# Altium schematic sheet 2_MOTORES_DE_PASSO.SchDoc
size Tabloid; SheetNumber: 2; SheetTotal: 4; SPICEModelCacheVFRLFGQA: <root> / <DocumentId>VFRLFGQA</DocumentId> / <CacheFrame Number="0"> / <Model Name="0603_885012206023_330nf" Kind="CKT"> / <Text>******* / .subckt 0603_885012206023_330nF 1 2 / Rser 1 3 0.0113479919005 / Lser 2 4 4.48567636E-10 / C1 3 4 0.00000033 / Rpar 3 4 1500000000 / .ends 0603_885012206023_330nF</Text> / </Model> / <Model Name="0603_885012206008_1nf" Kind="CKT"> / <Text>******* / .subckt 0603_885012206008_1nF 1 2 / Rser 1 3 0.24958 / Lser 2 4 0.00000000040399 / C1 3 4 0.000000001 / Rpar 3 4 10000000000 / .ends 0603_885012206008_1nF</Text> / </Model> / <Model Name="0603_885012206014_10nf" Kind="CKT"> / <Text>******* / .subckt 0603_885012206014_10nF 1 2 / Rser 1 3 0.04641 / Lser 2 4 0.00000000025735 / C1 3 4 0.00000001 / Rpar 3 4 10000000000 / .ends 0603_885012206014_10nF</Text> / </Model> / <Model Name="0603_885012206121_330nf" Kind="CKT"> / <Text>******* / .subckt 0603_885012206121_330nF 1 2 / Rser 1 3 0.0116331902783 / Lser 2 4 2.98906197E-10 / C1 3 4 0.00000033 / Rpar 3 4 1500000000 / .ends 0603_885012206121_330nF</Text> / </Model> / <Model Name="865080649011_33uf" Kind="CKT"> / <Text>******* / .subckt 865080649011_33uF 1 2 / Rser 1 3 0.64 / Lser 2 4 0.000000003917 / C1 3 4 0.000033 / Rpar 3 4 3030303.03030303 / .ends 865080649011_33uF</Text> / </Model> / </CacheFrame> / </root>
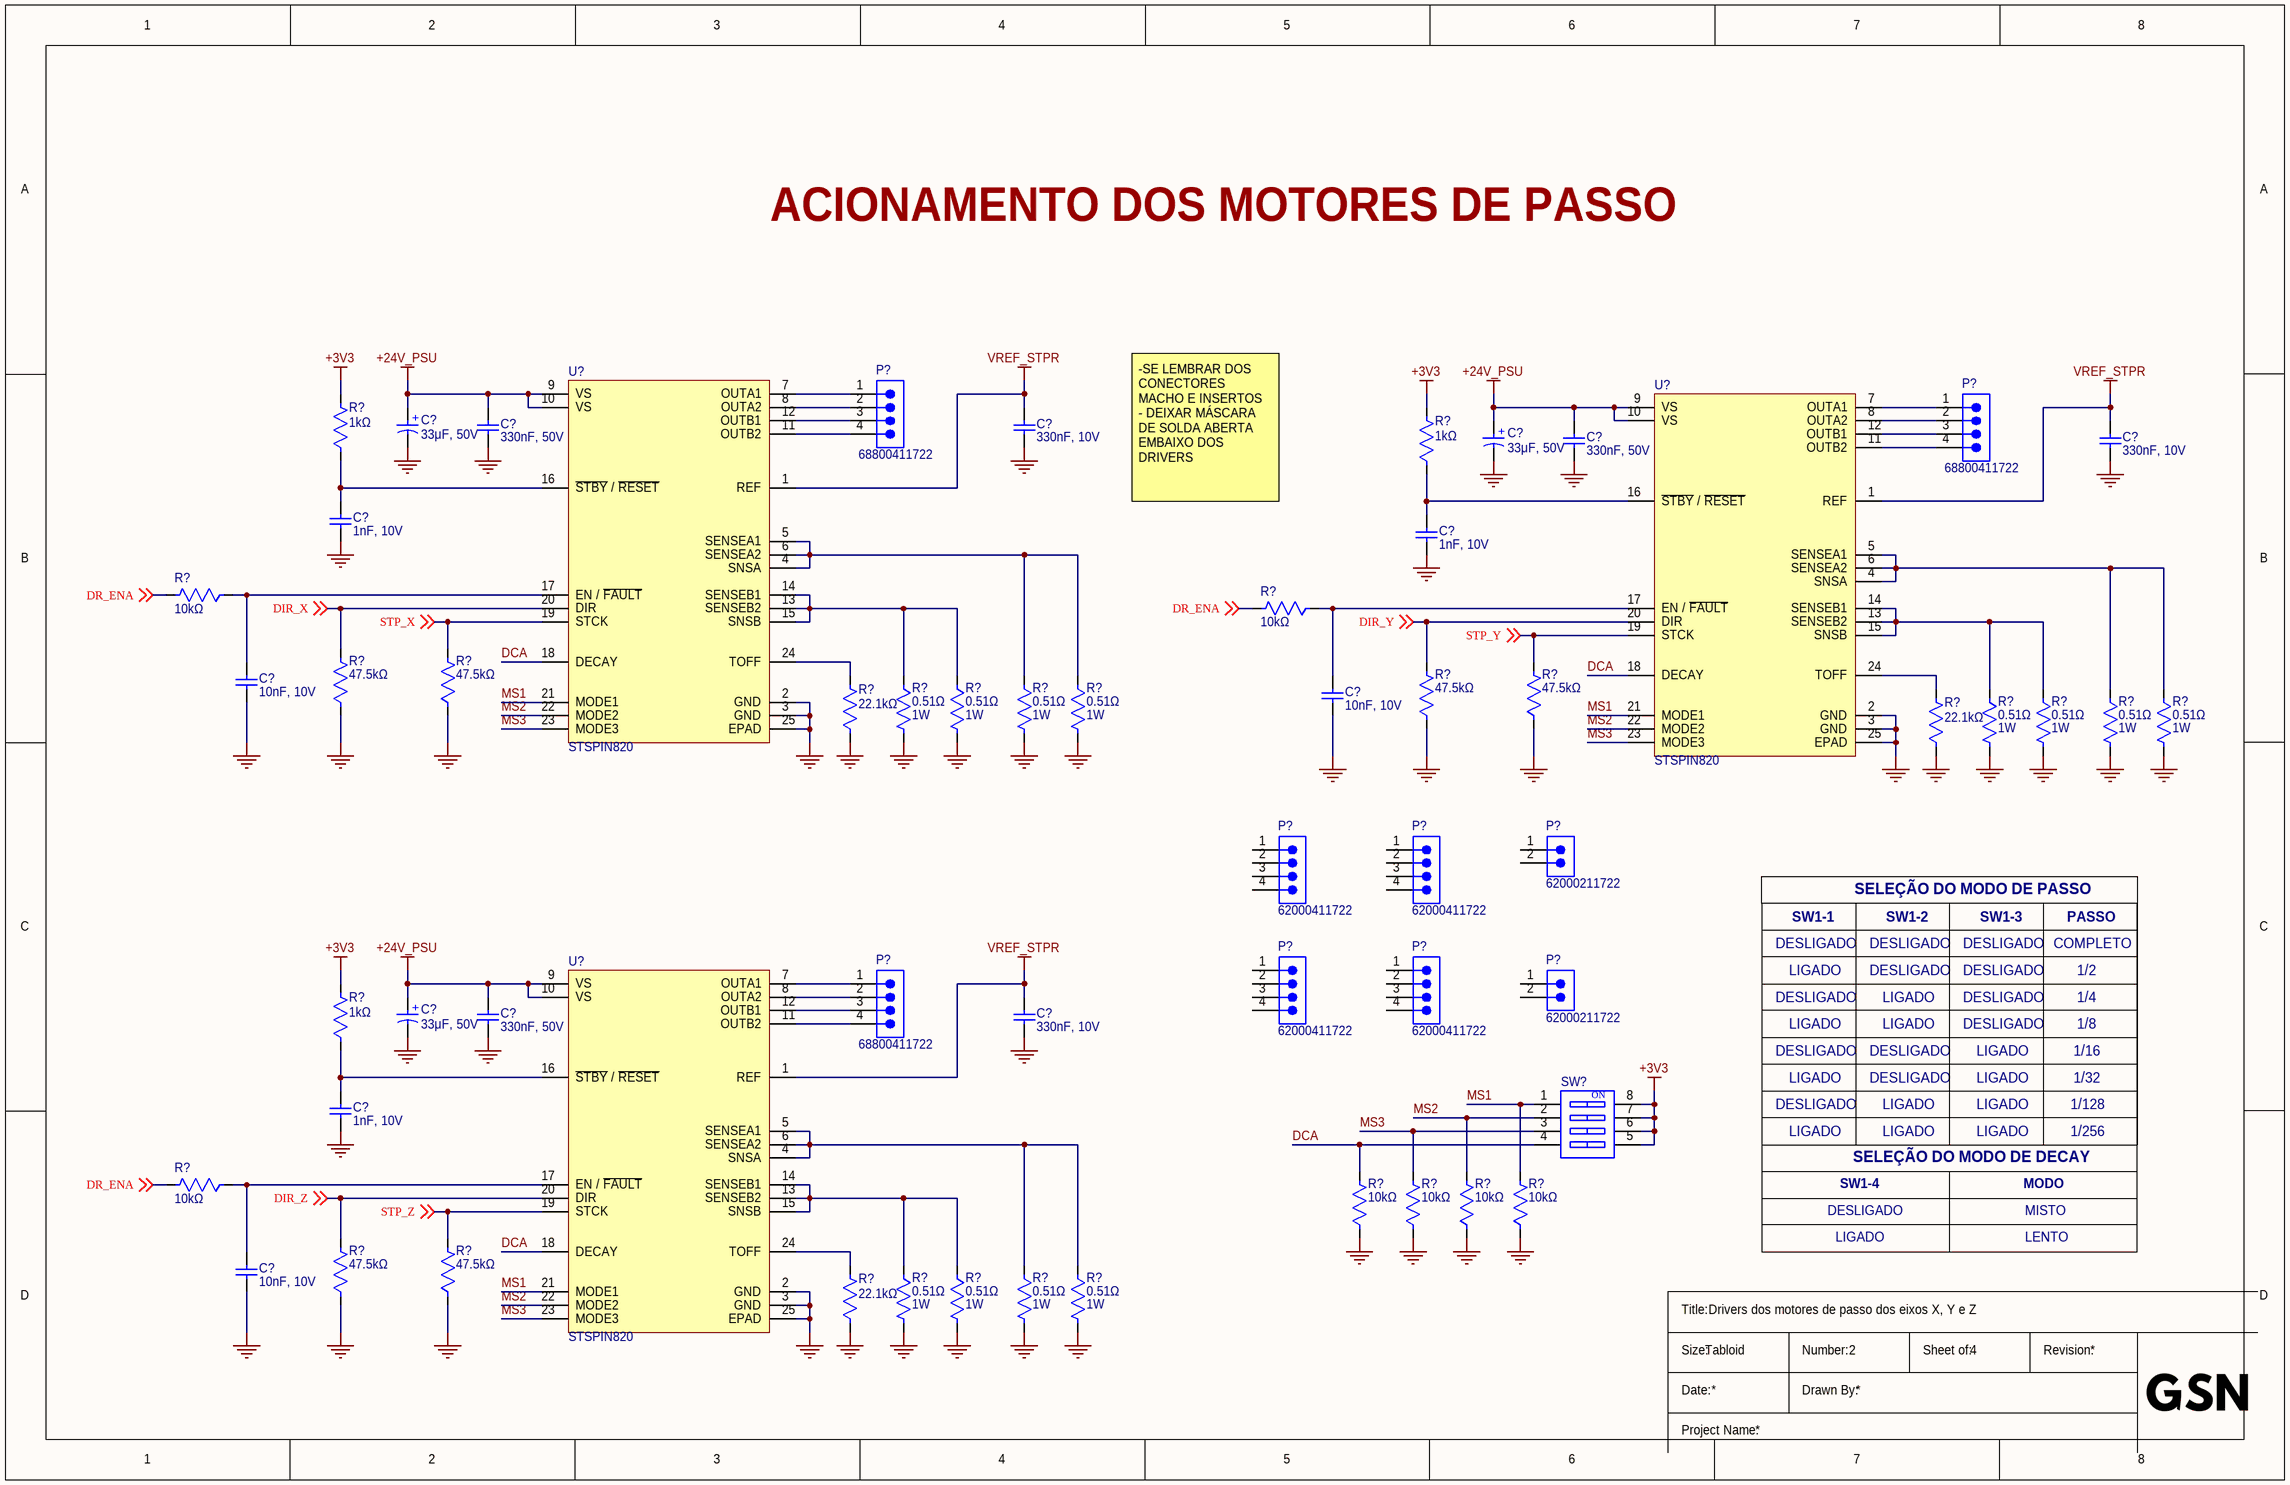
[diagram p0: 2_MOTORES_DE_PASSO.SchDoc]

## Parts
(Parts that share a designator on the sheet are numbered #1, #2 ... from top to bottom, then left to right.)
C?#1  33μF, 50V  [WCAP-ASLI_D8H6.5]
C?#2  33μF, 50V  [WCAP-ASLI_D8H6.5]
C?#3  330nF, 50V  [WCAP-CSGP_0603_L1.6W0.8H0.8_Reflow]
C?#4  330nF, 10V  [WCAP-CSGP_0603_L1.6W0.8H0.8_Reflow]
C?#5  330nF, 50V  [WCAP-CSGP_0603_L1.6W0.8H0.8_Reflow]
C?#6  330nF, 10V  [WCAP-CSGP_0603_L1.6W0.8H0.8_Reflow]
C?#7  1nF, 10V  [WCAP-CSGP_0603_L1.6W0.8H0.8_Reflow]
C?#8  1nF, 10V  [WCAP-CSGP_0603_L1.6W0.8H0.8_Reflow]
C?#9  10nF, 10V  [WCAP-CSGP_0603_L1.6W0.8H0.8_Reflow]
C?#10  10nF, 10V  [WCAP-CSGP_0603_L1.6W0.8H0.8_Reflow]
C?#11  33μF, 50V  [WCAP-ASLI_D8H6.5]
C?#12  330nF, 50V  [WCAP-CSGP_0603_L1.6W0.8H0.8_Reflow]
C?#13  330nF, 10V  [WCAP-CSGP_0603_L1.6W0.8H0.8_Reflow]
C?#14  1nF, 10V  [WCAP-CSGP_0603_L1.6W0.8H0.8_Reflow]
C?#15  10nF, 10V  [WCAP-CSGP_0603_L1.6W0.8H0.8_Reflow]
P?#1  68800411722  [68800411722]
P?#2  68800411722  [68800411722]
P?#3  62000411722  [62000411722]
P?#4  62000411722  [62000411722]
P?#5  62000211722  [62000211722]
P?#6  62000411722  [62000411722]
P?#7  62000411722  [62000411722]
P?#8  68800411722  [68800411722]
P?#9  62000211722  [62000211722]
R?#1  1kΩ  [0603-REFLOW]
R?#2  1kΩ  [0603-REFLOW]
R?#3  10kΩ  [0603-REFLOW]
R?#4  10kΩ  [0603-REFLOW]
R?#5  0.51Ω  Power Rating: 1W  [2010-REFLOW]
R?#6  0.51Ω  Power Rating: 1W  [2010-REFLOW]
R?#7  0.51Ω  Power Rating: 1W  [2010-REFLOW]
R?#8  0.51Ω  Power Rating: 1W  [2010-REFLOW]
R?#9  0.51Ω  Power Rating: 1W  [2010-REFLOW]
R?#10  0.51Ω  Power Rating: 1W  [2010-REFLOW]
R?#11  0.51Ω  Power Rating: 1W  [2010-REFLOW]
R?#12  0.51Ω  Power Rating: 1W  [2010-REFLOW]
R?#13  47.5kΩ  [0603-REFLOW]
R?#14  47.5kΩ  [0603-REFLOW]
R?#15  47.5kΩ  [0603-REFLOW]
R?#16  47.5kΩ  [0603-REFLOW]
R?#17  22.1kΩ  [0603-REFLOW]
R?#18  22.1kΩ  [0603-REFLOW]
R?#19  1kΩ  [0603-REFLOW]
R?#20  10kΩ  [0603-REFLOW]
R?#21  10kΩ  [0603-REFLOW]
R?#22  10kΩ  [0603-REFLOW]
R?#23  10kΩ  [0603-REFLOW]
R?#24  10kΩ  [0603-REFLOW]
R?#25  0.51Ω  Power Rating: 1W  [2010-REFLOW]
R?#26  0.51Ω  Power Rating: 1W  [2010-REFLOW]
R?#27  0.51Ω  Power Rating: 1W  [2010-REFLOW]
R?#28  0.51Ω  Power Rating: 1W  [2010-REFLOW]
R?#29  47.5kΩ  [0603-REFLOW]
R?#30  47.5kΩ  [0603-REFLOW]
R?#31  22.1kΩ  [0603-REFLOW]
SW?  416131160804  [416131160804]  (value not drawn)
U?#1  STSPIN820  [24-TQFPN]
U?#2  STSPIN820  [24-TQFPN]
U?#3  STSPIN820  [24-TQFPN]

## Nets
+3V3: R?#1.2 R?#2.2 R?#19.2 SW?.5 SW?.6 SW?.7 SW?.8
+24V_PSU: C?#1.1(P) C?#2.1(P) C?#3.2 C?#5.2 C?#11.1(P) C?#12.2 U?#1.9(VS) U?#1.10(VS) U?#2.9(VS) U?#2.10(VS) U?#3.9(VS) U?#3.10(VS)
GND: C?#1.2(N) C?#2.2(N) C?#3.1 C?#4.1 C?#5.1 C?#6.1 C?#7.1 C?#8.1 C?#9.1 C?#10.1 C?#11.2(N) C?#12.1 C?#13.1 C?#14.1 C?#15.1 R?#5.2 R?#6.2 R?#7.2 R?#8.2 R?#9.2 R?#10.2 R?#11.2 R?#12.2 R?#13.1 R?#14.1 R?#15.1 R?#16.1 R?#17.1 R?#18.1 R?#21.1 R?#22.1 R?#23.1 R?#24.1 R?#25.2 R?#26.2 R?#27.2 R?#28.2 R?#29.1 R?#30.1 R?#31.1 U?#1.2(GND) U?#1.3(GND) U?#1.25(EPAD) U?#2.2(GND) U?#2.3(GND) U?#2.25(EPAD) U?#3.2(GND) U?#3.3(GND) U?#3.25(EPAD)
VREF_STPR: C?#4.2 C?#6.2 C?#13.2 U?#1.1(REF) U?#2.1(REF) U?#3.1(REF)
DCA: R?#21.2 SW?.4 U?#1.18(DECAY) U?#2.18(DECAY) U?#3.18(DECAY)
DIR_X: R?#13.2 U?#1.20(DIR) ; off-sheet DIR_X
DIR_Y: R?#15.2 U?#2.20(DIR) ; off-sheet DIR_Y
DIR_Z: R?#29.2 U?#3.20(DIR) ; off-sheet DIR_Z
DR_ENA: R?#3.2 R?#4.2 R?#20.2 ; off-sheet DR_ENA
MS1: R?#24.2 SW?.1 U?#1.21(MODE1) U?#2.21(MODE1) U?#3.21(MODE1)
MS2: R?#23.2 SW?.2 U?#1.22(MODE2) U?#2.22(MODE2) U?#3.22(MODE2)
MS3: R?#22.2 SW?.3 U?#1.23(MODE3) U?#2.23(MODE3) U?#3.23(MODE3)
STP_X: R?#14.2 U?#1.19(STCK) ; off-sheet STP_X
STP_Y: R?#16.2 U?#2.19(STCK) ; off-sheet STP_Y
STP_Z: R?#30.2 U?#3.19(STCK) ; off-sheet STP_Z
NetC?#7_2: C?#7.2 R?#1.1 U?#1.16(~{STBY}_/_~{RESET})
NetC?#8_2: C?#8.2 R?#2.1 U?#2.16(~{STBY}_/_~{RESET})
NetC?#9_2: C?#9.2 R?#3.1 U?#1.17(EN_/_~{FAULT})
NetC?#10_2: C?#10.2 R?#4.1 U?#2.17(EN_/_~{FAULT})
NetC?#14_2: C?#14.2 R?#19.1 U?#3.16(~{STBY}_/_~{RESET})
NetC?#15_2: C?#15.2 R?#20.1 U?#3.17(EN_/_~{FAULT})
NetP?#1_1: P?#1.1 U?#1.7(OUTA1)
NetP?#1_2: P?#1.2 U?#1.8(OUTA2)
NetP?#1_3: P?#1.3 U?#1.12(OUTB1)
NetP?#1_4: P?#1.4 U?#1.11(OUTB2)
NetP?#2_1: P?#2.1 U?#2.7(OUTA1)
NetP?#2_2: P?#2.2 U?#2.8(OUTA2)
NetP?#2_3: P?#2.3 U?#2.12(OUTB1)
NetP?#2_4: P?#2.4 U?#2.11(OUTB2)
NetP?#8_1: P?#8.1 U?#3.7(OUTA1)
NetP?#8_2: P?#8.2 U?#3.8(OUTA2)
NetP?#8_3: P?#8.3 U?#3.12(OUTB1)
NetP?#8_4: P?#8.4 U?#3.11(OUTB2)
NetR?#5_1: R?#5.1 R?#6.1 U?#1.13(SENSEB2) U?#1.14(SENSEB1) U?#1.15(SNSB)
NetR?#7_1: R?#7.1 R?#8.1 U?#1.4(SNSA) U?#1.5(SENSEA1) U?#1.6(SENSEA2)
NetR?#9_1: R?#9.1 R?#10.1 U?#2.13(SENSEB2) U?#2.14(SENSEB1) U?#2.15(SNSB)
NetR?#11_1: R?#11.1 R?#12.1 U?#2.4(SNSA) U?#2.5(SENSEA1) U?#2.6(SENSEA2)
NetR?#17_2: R?#17.2 U?#1.24(TOFF)
NetR?#18_2: R?#18.2 U?#2.24(TOFF)
NetR?#25_1: R?#25.1 R?#26.1 U?#3.13(SENSEB2) U?#3.14(SENSEB1) U?#3.15(SNSB)
NetR?#27_1: R?#27.1 R?#28.1 U?#3.4(SNSA) U?#3.5(SENSEA1) U?#3.6(SENSEA2)
NetR?#31_2: R?#31.2 U?#3.24(TOFF)

Not connected (* = marked no-connect by the designer): P?#3 1 2 3 4; P?#4 1 2 3 4; P?#5 1 2; P?#6 1 2 3 4; P?#7 1 2 3 4; P?#9 1 2

## Notes on the sheet
- ACIONAMENTO DOS MOTORES DE PASSO
- -SE LEMBRAR DOS CONECTORES MACHO E INSERTOS
  - DEIXAR MÁSCARA DE SOLDA ABERTA EMBAIXO DOS DRIVERS
- SELEÇÃO DO MODO DE PASSO
- DESLIGADO
- SW1-1
- SW1-2
- SW1-3
- COMPLETO
- PASSO
- LIGADO
- 1/2
- 1/4
- 1/8
- 1/16
- 1/32
- SELEÇÃO DO MODO DE DECAY
- 1/128
- 1/256
- SW1-4
- MODO
- MISTO
- LENTO
- Drivers dos motores de passo dos eixos X, Y e Z
- Title:
- Size:
- Tabloid
- Number:
- Sheet of:
- Revision:
- Date:
- Project Name:
- Drawn By:
- (in symbol 416131160804) ON
- (in symbol 865080649011) +

## Library data of the parts
C?#1 C?#2 C?#11 = 865080649011: WCAP-ASLI Aluminum Electrolytic Capacitor, V-Chip, SMT, 8mm x 6.5mm, 33μF, 50V; Manufacturer: Wurth Elektronik; Capacitance: 33uF; Dissipation Factor: 12%; Endurance: 2000h; Impedance: 700mohm; Leakage Current: 16.5uA; Ripple Current: 200mA; Manufacturer Part Number: 865080649011; Category: Aluminum Electrolytic Capacitors; Match Code: WCAP-ASLI; ComponentLink1Description: Website Link; ComponentLink1URL: https://www.we-online.com/redexpert/article/865080649011?ad; ComponentLink2Description: Datasheet Link; ComponentLink2URL: https://www.we-online.com/redexpert/spec/865080649011?ad; Mount: Surface Mount; Operating Temperature Min: -55degC; Operating Temperature Max: 105degC; Packaging: Tape and Reel; Height: 6.5mm; Diameter: 8mm; Rated Voltage (DC): 50V
C?#3 C?#5 C?#12 = 885012206121: WCAP-CSGP Multilayer Ceramic Chip Capacitor, General Purpose, size 0603, 330nF, 50V; Manufacturer: Wurth Elektronik; Case/Size Code: 0603; Capacitance Tolerance: +/-10%; Ceramic Type: X7R; Dissipation Factor: 10%; Insulation Resistance: 1.5GΩ; Technical Reference: X7R0603334K050DFCT10000; Manufacturer Part Number: 885012206121; Category: Multilayer Ceramic Chip Capacitors; Match Code: WCAP-CSGP; ComponentLink1Description: Website Link; ComponentLink1URL: https://www.we-online.com/redexpert/article/885012206121?ad; ComponentLink2Description: Datasheet Link; ComponentLink2URL: https://www.we-online.com/redexpert/spec/885012206121?ad; Mount: Surface Mount; Min Operating Temperature: -55°C; Max Operating Temperature: 125°C; Packaging: Tape and Reel; Length: 1.6mm; Width: 0.8mm; Height: 0.8mm; Capacitance: 330nF; Rated Voltage (DC): 50V
C?#4 C?#6 C?#13 = 885012206023: WCAP-CSGP Multilayer Ceramic Chip Capacitor, General Purpose, size 0603, 330nF, 10V; Manufacturer: Wurth Elektronik; Case/Size Code: 0603; Capacitance Tolerance: +/-10%; Ceramic Type: X7R; Dissipation Factor: 10%; Insulation Resistance: 1.5GΩ; Technical Reference: X7R0603334K010DFCT10000; Manufacturer Part Number: 885012206023; Category: Multilayer Ceramic Chip Capacitors; Match Code: WCAP-CSGP; ComponentLink1Description: Website Link; ComponentLink1URL: https://www.we-online.com/redexpert/article/885012206023?ad; ComponentLink2Description: Datasheet Link; ComponentLink2URL: https://www.we-online.com/redexpert/spec/885012206023?ad; Mount: Surface Mount; Min Operating Temperature: -55°C; Max Operating Temperature: 125°C; Packaging: Tape and Reel; Length: 1.6mm; Width: 0.8mm; Height: 0.8mm; Capacitance: 330nF; Rated Voltage (DC): 10V
C?#7 C?#8 C?#14 = 885012206008: WCAP-CSGP Multilayer Ceramic Chip Capacitor, General Purpose, size 0603, 1nF, 10V; Manufacturer: Wurth Elektronik; Case/Size Code: 0603; Capacitance Tolerance: +/-10%; Ceramic Type: X7R; Dissipation Factor: 5%; Insulation Resistance: 10GΩ; Technical Reference: X7R0603102K010DFCT10000; Manufacturer Part Number: 885012206008; Category: Multilayer Ceramic Chip Capacitors; Match Code: WCAP-CSGP; ComponentLink1Description: Website Link; ComponentLink1URL: https://www.we-online.com/redexpert/article/885012206008?ad; ComponentLink2Description: Datasheet Link; ComponentLink2URL: https://www.we-online.com/redexpert/spec/885012206008?ad; Mount: Surface Mount; Min Operating Temperature: -55°C; Max Operating Temperature: 125°C; Packaging: Tape and Reel; Length: 1.6mm; Width: 0.8mm; Height: 0.8mm; Capacitance: 1nF; Rated Voltage (DC): 10V
C?#9 C?#10 C?#15 = 885012206014: WCAP-CSGP Multilayer Ceramic Chip Capacitor, General Purpose, size 0603, 10nF, 10V; Manufacturer: Wurth Elektronik; Case/Size Code: 0603; Capacitance Tolerance: +/-10%; Ceramic Type: X7R; Dissipation Factor: 5%; Insulation Resistance: 10GΩ; Technical Reference: X7R0603103K010DFCT10000; Manufacturer Part Number: 885012206014; Category: Multilayer Ceramic Chip Capacitors; Match Code: WCAP-CSGP; ComponentLink1Description: Website Link; ComponentLink1URL: https://www.we-online.com/redexpert/article/885012206014?ad; ComponentLink2Description: Datasheet Link; ComponentLink2URL: https://www.we-online.com/redexpert/spec/885012206014?ad; Mount: Surface Mount; Min Operating Temperature: -55°C; Max Operating Temperature: 125°C; Packaging: Tape and Reel; Length: 1.6mm; Width: 0.8mm; Height: 0.8mm; Capacitance: 10nF; Rated Voltage (DC): 10V
P?#1 P?#2 P?#8 = 68800411722: WR-WTB “J” Type THT Male Horizontal Shrouded Header, pitch 2.5 mm, 4 pins; Manufacturer: Wurth Elektronik; Contact Resistance: 20 mohm; Rated Current: 3 A; Working Voltage: 250 V(AC); Withstanding Voltage: 800 V(AC); Manufacturer Part Number: 68800411722; Category: Wire-to-Board Connector; Match Code: WR-WTB; ComponentLink1Description: Website Link; ComponentLink1URL: https://www.we-online.com/redexpert/article/68800411722?ad; ComponentLink2Description: Datasheet Link; ComponentLink2URL: https://www.we-online.com/redexpert/spec/68800411722?ad; Mount: Through Hole; Operating Temperature Min: -25degC; Operating Temperature Max: 85degC; Packaging: Bag; Length: 12.5 mm; Width: 8.3 mm; Height: 4.2 mm; Gender: Male; Number of Pins: 4; Number of Rows: 1; Orientation: Horizontal; Lead Pitch: 2.5 mm
P?#3 P?#4 P?#6 P?#7 = 62000411722: WR-WTB THT Male Horizontal Shrouded Header, pitch 2 mm, 4 pins; Manufacturer: Wurth Elektronik; Contact Resistance: 20 mohm; Rated Current: 2 A; Working Voltage: 125 V(AC); Withstanding Voltage: 800 V(AC); Manufacturer Part Number: 62000411722; Category: Wire-to-Board Connector; Match Code: WR-WTB; ComponentLink1Description: Website Link; ComponentLink1URL: https://www.we-online.com/redexpert/article/62000411722?ad; ComponentLink2Description: Datasheet Link; ComponentLink2URL: https://www.we-online.com/redexpert/spec/62000411722?ad; Mount: Through Hole; Operating Temperature Min: -25degC; Operating Temperature Max: 85degC; Packaging: Bag; Length: 10 mm; Width: 7.6 mm; Height: 4.5 mm; Gender: Male; Number of Pins: 4; Number of Rows: 1; Orientation: Horizontal; Lead Pitch: 2 mm
P?#5 P?#9 = 62000211722: WR-WTB THT Male Horizontal Shrouded Header, pitch 2 mm, 2 pins; Manufacturer: Wurth Elektronik; Contact Resistance: 20 mohm; Rated Current: 2 A; Working Voltage: 125 V(AC); Withstanding Voltage: 800 V(AC); Manufacturer Part Number: 62000211722; Category: Wire-to-Board Connector; Match Code: WR-WTB; ComponentLink1Description: Website Link; ComponentLink1URL: https://www.we-online.com/redexpert/article/62000211722?ad; ComponentLink2Description: Datasheet Link; ComponentLink2URL: https://www.we-online.com/redexpert/spec/62000211722?ad; Mount: Through Hole; Operating Temperature Min: -25degC; Operating Temperature Max: 85degC; Packaging: Bag; Length: 6 mm; Width: 7.6 mm; Height: 4.5 mm; Gender: Male; Number of Pins: 2; Number of Rows: 1; Orientation: Horizontal; Lead Pitch: 2 mm
R?#1 R?#2 R?#19 = RC0603FR-071KL: RES 1K OHM 1% 1/10W 0603; Manufacturer: Yageo Group; Max Power Dissipation: 100mW; Temperature Coefficient: ±200ppm/°C; Voltage Rating (AC): 50V; Voltage Rating: 75V; Supplier Part Number: 311-1.00KHRCT-ND; Manufacturer Part Number: RC0603FR-071KL; Value: 1kΩ; Case Code (Imperial): 0603; Case Code (Metric): 1608; Case/Package: 0603; Category: Chip SMD Resistors; China RoHS: Non-Compliant; Composition: Thick Film; Contact Plating: Tin; Depth: 800µm; Features: Moisture Resistant; Height: 450µm; Lead Free: Lead Free; Length: 1.6mm; Lifecycle Status: Production; Max Operating Temperature: 155°C; Military Standard: Not; Min Operating Temperature: -55°C; Mounting Technology: Surface Mount; Number of Terminals: 2; Number of Terminations: 2; Packaging: Tape & Reel; Power Dissipation: 100mW; Power Rating: 100mW; Radiation Hardening: No; REACH SVHC: Yes; RoHS: Compliant; Supplier: DigiKey; Termination: SMD/SMT; Tolerance: 1%; Component Link Description: https://www.yageogroup.com/content/datasheet/asset/file/PYU-RC_GROUP_51_ROHS_L; Component Link URL: https://www.yageogroup.com/content/datasheet/asset/file/PYU-RC_GROUP_51_ROHS_L; Datasheet: https://www.yageogroup.com/content/datasheet/asset/file/PYU-RC_GROUP_51_ROHS_L; Voltage Rating (DC): 50V; Weight: 2.012816mg; Width: 800µm; Working Voltage: 75V
R?#3 R?#4 R?#20-R?#24 = RC0603FR-0710KL: RES 10K OHM 1% 1/10W 0603; Manufacturer: Yageo Group; Max Power Dissipation: 100mW; Temperature Coefficient: ±200ppm/°C; Voltage Rating (AC): 50V; Voltage Rating: 75V; Supplier Part Number: 311-10.0KHRCT-ND; Manufacturer Part Number: RC0603FR-0710KL; Value: 10kΩ; Case Code (Imperial): 0603; Case Code (Metric): 1608; Case/Package: 0603; Category: Chip SMD Resistors; China RoHS: Non-Compliant; Composition: Thick Film; Contact Plating: Tin; Depth: 800µm; Features: Moisture Resistant; Height: 450µm; Lead Free: Lead Free; Length: 1.6mm; Lifecycle Status: Production; Max Operating Temperature: 155°C; Military Standard: Not; Min Operating Temperature: -55°C; Mounting Technology: Surface Mount; Number of Terminals: 2; Number of Terminations: 2; Packaging: Tape & Reel; Power Dissipation: 100mW; Power Rating: 100mW; Radiation Hardening: No; REACH SVHC: Yes; RoHS: Compliant; Supplier: DigiKey; Termination: SMD/SMT; Tolerance: 1%; Component Link Description: https://www.yageogroup.com/content/datasheet/asset/file/PYU-RC_GROUP_51_ROHS_L; Component Link URL: https://www.yageogroup.com/content/datasheet/asset/file/PYU-RC_GROUP_51_ROHS_L; Datasheet: https://www.yageogroup.com/content/datasheet/asset/file/PYU-RC_GROUP_51_ROHS_L; Voltage Rating (DC): 50V; Weight: 2.012816mg; Width: 800µm; Working Voltage: 75V
R?#5-R?#12 R?#25-R?#28 = RCWE2010R510FKEA: RES 0.51 OHM 1% 1W 2010; Manufacturer: Vishay; Value: 510mΩ; Temperature Coefficient: 100ppm/°C; Working Voltage: 714.1mV; Supplier: DigiKey; Supplier Part Number: RCWE.51GCT-ND; Manufacturer Part Number: RCWE2010R510FKEA; RoHS: Compliant; Category: Chip SMD Resistors; Stock: 6435; Pricing: 1=0.65, 10=0.417, 25=0.3544, 50=0.3156, 100=0.2824, 250=0.24596, 500=0.22314, 1000=0.20376 (USD); Case/Package: 2010; Case Code (Imperial): 2010; Case Code (Metric): 5025; China RoHS: Non-Compliant; Composition: Thick Film; Contact Plating: Tin; Features: Automotive AEC-Q200, Moisture Resistant; Height: 600µm; Length: 5.0038mm; Lifecycle Status: Production; Max Operating Temperature: 155°C; Max Power Dissipation: 1W; Min Operating Temperature: -55°C; Mounting Technology: Surface Mount; Pins: 2; Number of Terminals: 2; Number of Terminations: 2; Power Dissipation: 1W; Radiation Hardening: No; REACH SVHC: Yes; Schedule B: 8533210045, 8533210045|8533210045|8533210045|8533210045|8533210045; Termination: SMD/SMT; Tolerance: 1%; Width: 2.5mm; ComponentLink1URL: https://datasheet.octopart.com:443/RCWE2010R510FKEA-Vishay-datasheet-170667730.pdf?src-supplier=IHS; ComponentLink1Description: https://datasheet.octopart.com:443/RCWE2010R510FKEA-Vishay-datasheet-170667730.pdf?src-supplier=IHS; ComponentLink2URL: https://datasheet.octopart.com:443/RCWE2010R510FKEA-Vishay-datasheet-78835242.pdf?src-supplier=Newark; ComponentLink2Description: https://datasheet.octopart.com:443/RCWE2010R510FKEA-Vishay-datasheet-78835242.pdf?src-supplier=Newark; ComponentLink3URL: https://datasheet.octopart.com:443/RCWE2010R510FKEA-Vishay-datasheet-10025643.pdf?src-supplier=element14+APAC; ComponentLink3Description: https://datasheet.octopart.com:443/RCWE2010R510FKEA-Vishay-datasheet-10025643.pdf?src-supplier=element14+APAC; ComponentLink4URL: http://sigma.octopart.com:80/rohs_statement/Vishay-company-15.pdf?src-supplier=Compliance+Statements; ComponentLink4Description: http://sigma.octopart.com:80/rohs_statement/Vishay-company-15.pdf?src-supplier=Compliance+Statements
R?#13-R?#16 R?#29 R?#30 = RC0603FR-0747K5L: RES 47.5K OHM 1% 1/10W 0603; Manufacturer: Yageo Group; Max Power Dissipation: 100mW; Temperature Coefficient: ±200ppm/°C; Voltage Rating (AC): 50V; Voltage Rating: 75V; Supplier Part Number: 311-47.5KHRCT-ND; Manufacturer Part Number: RC0603FR-0747K5L; Value: 47.5kΩ; Case Code (Imperial): 0603; Case Code (Metric): 1608; Case/Package: 0603; Category: Chip SMD Resistors; China RoHS: Non-Compliant; Composition: Thick Film; Contact Plating: Tin; Depth: 800µm; Features: Moisture Resistant; Height: 450µm; Lead Free: Lead Free; Length: 1.6mm; Lifecycle Status: Production; Max Operating Temperature: 155°C; Military Standard: Not; Min Operating Temperature: -55°C; Mounting Technology: Surface Mount; Number of Terminals: 2; Number of Terminations: 2; Packaging: Tape & Reel; Power Dissipation: 100mW; Power Rating: 100mW; Radiation Hardening: No; REACH SVHC: Yes; RoHS: Compliant; Supplier: DigiKey; Termination: SMD/SMT; Tolerance: 1%; Component Link Description: https://www.yageogroup.com/content/datasheet/asset/file/PYU-RC_GROUP_51_ROHS_L; Component Link URL: https://www.yageogroup.com/content/datasheet/asset/file/PYU-RC_GROUP_51_ROHS_L; Datasheet: https://www.yageogroup.com/content/datasheet/asset/file/PYU-RC_GROUP_51_ROHS_L; Voltage Rating (DC): 50V; Weight: 2.012816mg; Width: 800µm; Working Voltage: 75V
R?#17 R?#18 R?#31 = RC0603FR-0722K1L: RES 22.1K OHM 1% 1/10W 0603; Manufacturer: Yageo Group; Max Power Dissipation: 100mW; Temperature Coefficient: ±200ppm/°C; Voltage Rating (AC): 50V; Voltage Rating: 75V; Supplier Part Number: 311-22.1KHRCT-ND; Manufacturer Part Number: RC0603FR-0722K1L; Value: 22.1kΩ; Case Code (Imperial): 0603; Case Code (Metric): 1608; Case/Package: 0603; Category: Chip SMD Resistors; China RoHS: Non-Compliant; Composition: Thick Film; Contact Plating: Tin; Depth: 800µm; Features: Moisture Resistant; Height: 450µm; Lead Free: Lead Free; Length: 1.6mm; Lifecycle Status: Production; Max Operating Temperature: 155°C; Military Standard: Not; Min Operating Temperature: -55°C; Mounting Technology: Surface Mount; Number of Terminals: 2; Number of Terminations: 2; Packaging: Tape & Reel; Power Dissipation: 100mW; Power Rating: 100mW; Radiation Hardening: No; REACH SVHC: Yes; RoHS: Compliant; Supplier: DigiKey; Termination: SMD/SMT; Tolerance: 1%; Component Link Description: https://www.yageogroup.com/content/datasheet/asset/file/PYU-RC_GROUP_51_ROHS_L; Component Link URL: https://www.yageogroup.com/content/datasheet/asset/file/PYU-RC_GROUP_51_ROHS_L; Datasheet: https://www.yageogroup.com/content/datasheet/asset/file/PYU-RC_GROUP_51_ROHS_L; Voltage Rating (DC): 50V; Weight: 2.012816mg; Width: 800µm; Working Voltage: 75V
SW? = 416131160804: WS-DISV Small Compact SMD Dip Switch, Flat Actuator with Top Tape, pitch 1.27mm, 4p; Manufacturer: Wurth Elektronik; Actuator Type: Flat Type; Operation Force: 500g; Number of Poles: 4; Rated Current Non-Switching: 100mA; Rated Current Switching: 25mA; Rated Voltage Non-Switching: 50VDC; Rated Voltage Switching: 24VDC; Manufacturer Part Number: 416131160804; Category: Dip Switches; Match Code: WS-DISV; ComponentLink1Description: Website Link; ComponentLink1URL: https://www.we-online.com/redexpert/article/416131160804?ad; ComponentLink2Description: Datasheet Link; ComponentLink2URL: https://www.we-online.com/redexpert/spec/416131160804?ad; Mount: Surface Mount; Min Operating Temperature: -40°C; Max Operating Temperature: 85°C; Packaging: Tape and Reel; Contact Material: Copper Alloy; Contact Plating: Gold; Pitch: 1.27mm
U?#1-U?#3 = STSPIN820: IC MTR DRVR BIPLR 7-45V 24TFQFPN; Manufacturer: STMicroelectronics; Throw Configuration: STEPPER MOTOR CONTROLLER; Supplier: Digikey; Supplier Part Number: 497-17713-1-ND; Manufacturer Part Number: STSPIN820; RoHS: Yes; Category: Motor Drives; Stock: 11767; Pricing: 1=3.03, 10=2.271, 25=2.0804, 100=1.8709, 250=1.77096, 500=1.71068, 1000=1.66108 (USD); Reach SVHC Compliant: Yes; RoHS Compliant: Yes; ComponentLink1URL: https://datasheet.ciiva.com:443/pdfs/VipMasterIC/IC/SGST/SGST-S-A0005002811/SGST-S-A0005002811-1.pdf?src-supplier=IHS+Markit; ComponentLink1Description: https://datasheet.ciiva.com:443/pdfs/VipMasterIC/IC/SGST/SGST-S-A0005002811/SGST-S-A0005002811-1.pdf?src-supplier=IHS+Markit; ComponentLink2URL: http://www.farnell.com/datasheets/2549178.pdf?src-supplier=Farnell; ComponentLink2Description: http://www.farnell.com/datasheets/2549178.pdf?src-supplier=Farnell; ComponentLink3URL: http://www.st.com/content/ccc/resource/technical/document/datasheet/group3/64/0a/8b/fb/e5/29/46/34/DM00436631/files/DM00436631.pdf/jcr:content/translations/en.DM00436631.pdf?src-supplier=Digikey; ComponentLink3Description: http://www.st.com/content/ccc/resource/technical/document/datasheet/group3/64/0a/8b/fb/e5/29/46/34/DM00436631/files/DM00436631.pdf/jcr:content/translations/en.DM00436631.pdf?src-supplier=Digikey; ComponentLink4URL: https://datasheet.octopart.com/STSPIN820-STMicroelectronics-datasheet-99887157.pdf?src-supplier=Newark; ComponentLink4Description: https://datasheet.octopart.com/STSPIN820-STMicroelectronics-datasheet-99887157.pdf?src-supplier=Newark; ComponentLink5URL: http://www.farnell.com/datasheets/2549178.pdf?src-supplier=Newark; ComponentLink5Description: http://www.farnell.com/datasheets/2549178.pdf?src-supplier=Newark; ComponentLink6URL: https://datasheet.octopart.com/STSPIN820-STMicroelectronics-datasheet-163660309.pdf?src-supplier=SHENGYU+ELECTRONICS; ComponentLink6Description: https://datasheet.octopart.com/STSPIN820-STMicroelectronics-datasheet-163660309.pdf?src-supplier=SHENGYU+ELECTRONICS